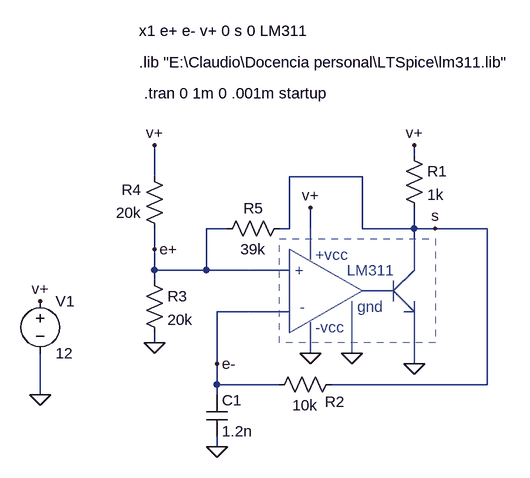
[diagram p0: schematic comp_prueba.asc]
comp_prueba.asc, the LTspice schematic file:
Version 4
SHEET 1 1420 684
WIRE 832 -96 832 -112
WIRE 432 -64 432 -112
WIRE 752 -64 640 -64
WIRE 544 16 512 16
WIRE 640 16 640 -64
WIRE 640 16 624 16
WIRE 672 16 672 -16
WIRE 752 16 752 -64
WIRE 832 16 832 -16
WIRE 832 16 752 16
WIRE 864 16 832 16
WIRE 944 16 864 16
WIRE 832 32 832 16
WIRE 432 48 432 16
WIRE 432 80 432 48
WIRE 512 80 512 16
WIRE 512 80 432 80
WIRE 592 80 512 80
WIRE 432 96 432 80
WIRE 576 144 528 144
WIRE 432 192 432 176
WIRE 528 224 528 144
WIRE 528 256 528 224
WIRE 624 256 528 256
WIRE 944 256 944 16
WIRE 944 256 704 256
WIRE 256 272 256 208
WIRE 528 272 528 256
WIRE 528 352 528 336
FLAG 256 272 0
FLAG 256 128 v+
FLAG 432 48 e+
FLAG 864 16 s
FLAG 528 224 e-
FLAG 528 352 0
FLAG 432 192 0
FLAG 832 -112 v+
FLAG 432 -112 v+
FLAG 672 -16 v+
FLAG 832 224 0
FLAG 736 208 0
FLAG 672 208 0
SYMBOL voltage 256 112 R0
WINDOW 123 0 0 Left 0
WINDOW 39 0 0 Left 0
SYMATTR InstName V1
SYMATTR Value 12
SYMBOL res 816 -112 R0
SYMATTR InstName R1
SYMATTR Value 1k
SYMBOL cap 512 272 R0
SYMATTR InstName C1
SYMATTR Value 1.2n
SYMBOL res 720 240 R90
WINDOW 0 58 10 VBottom 2
WINDOW 3 32 56 VTop 2
SYMATTR InstName R2
SYMATTR Value 10k
SYMBOL res 416 80 R0
SYMATTR InstName R3
SYMATTR Value 20k
SYMBOL res 448 32 R180
WINDOW 0 36 76 Left 2
WINDOW 3 36 40 Left 2
SYMATTR InstName R4
SYMATTR Value 20k
SYMBOL res 640 0 R90
WINDOW 0 0 56 VBottom 2
WINDOW 3 32 56 VTop 2
SYMATTR InstName R5
SYMATTR Value 39k
TEXT 416 -192 Left 2 !.tran 0 1m 0 .001m startup
TEXT 408 -288 Left 2 !x1 e+ e- v+ 0 s 0 LM311
TEXT 408 -240 Left 2 !.lib "E:\\Claudio\\Docencia personal\\LTSpice\\lm311.lib"
TEXT 648 80 Left 2 ;+
TEXT 656 136 Left 2 ;-
TEXT 680 56 Left 2 ;+vcc
TEXT 680 168 Left 2 ;-vcc
TEXT 744 136 Left 2 ;gnd
TEXT 728 80 Left 2 ;LM311
LINE Normal 640 176 640 48
LINE Normal 752 112 640 176
LINE Normal 640 48 752 112
LINE Normal 800 112 752 112
LINE Normal 800 96 800 112
LINE Normal 800 128 800 96
LINE Normal 800 112 800 128
LINE Normal 816 128 800 112
LINE Normal 832 144 816 128
LINE Normal 832 128 832 144
LINE Normal 832 144 832 128
LINE Normal 816 144 832 144
LINE Normal 832 80 800 112
LINE Normal 832 32 832 80
LINE Normal 832 224 832 144
LINE Normal 672 16 672 64
LINE Normal 672 208 672 160
LINE Normal 736 208 736 128
LINE Normal 576 80 640 80
LINE Normal 576 144 640 144
RECTANGLE Normal 864 192 624 32 1

The netlist it stands for:
* comp_prueba.asc
V1 v+ 0 12
R1 v+ s 1k
C1 e- 0 1.2n
R2 s e- 10k
R3 e+ 0 20k
R4 e+ v+ 20k
R5 s e+ 39k
.tran 0 1m 0 .001m startup
x1 e+ e- v+ 0 s 0 LM311
.lib "E:\Claudio\Docencia personal\LTSpice\lm311.lib"
* +
* -
* +vcc
* -vcc
* gnd
* LM311
.backanno
.end